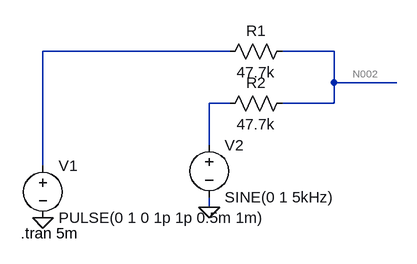
[diagram p0: schematic Сумматор_AC.asc]
Сумматор_AC.asc, the LTspice schematic file:
Version 4
SHEET 1 880 680
WIRE 208 16 -80 16
WIRE 368 16 288 16
WIRE 368 64 368 16
WIRE 464 64 368 64
WIRE 208 96 176 96
WIRE 368 96 368 64
WIRE 368 96 288 96
WIRE 176 160 176 96
WIRE -80 192 -80 16
WIRE 176 256 176 240
FLAG -80 272 0
FLAG 176 256 0
SYMBOL voltage -80 176 R0
WINDOW 123 0 0 Left 2
WINDOW 39 0 0 Left 2
SYMATTR InstName V1
SYMATTR Value PULSE(0 1 0 1p 1p 0.5m 1m)
SYMBOL voltage 176 144 R0
WINDOW 123 0 0 Left 2
WINDOW 39 0 0 Left 2
SYMATTR InstName V2
SYMATTR Value SINE(0 1 5kHz)
SYMBOL res 304 0 R90
WINDOW 0 0 56 VBottom 2
WINDOW 3 32 56 VTop 2
SYMATTR InstName R1
SYMATTR Value 47.7k
SYMBOL res 304 80 R90
WINDOW 0 0 56 VBottom 2
WINDOW 3 32 56 VTop 2
SYMATTR InstName R2
SYMATTR Value 47.7k
TEXT -114 296 Left 2 !.tran 5m

The netlist it stands for:
* Сумматор_AC.asc
V1 N001 0 PULSE(0 1 0 1p 1p 0.5m 1m)
V2 N003 0 SINE(0 1 5kHz)
R1 N002 N001 47.7k
R2 N002 N003 47.7k
.tran 5m
.backanno
.end

* Results of the author's LTspice run, read from the files saved beside the schematic
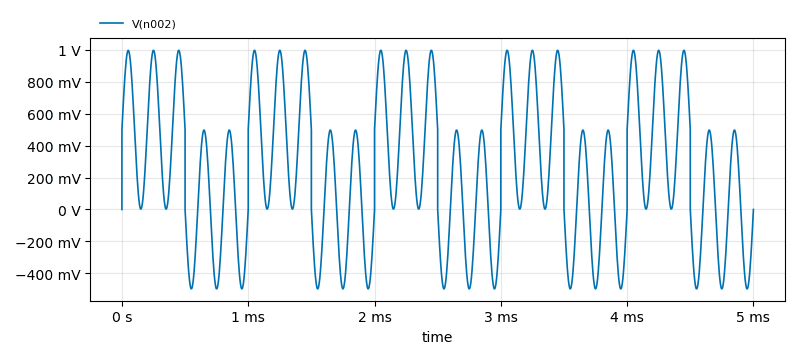
[diagram p1: Transient Analysis of Сумматор_AC.asc, plotted from the saved traces]
* Transient Analysis, 1 run:
*   V(n002): min -497.1 mV, max 997.1 mV, average 250 mV, rms 529.4 mV, last 0 V